# Altium schematic sheet Outputs.SchDoc: Controlled Outputs
size A4; DrawnBy: oaba200
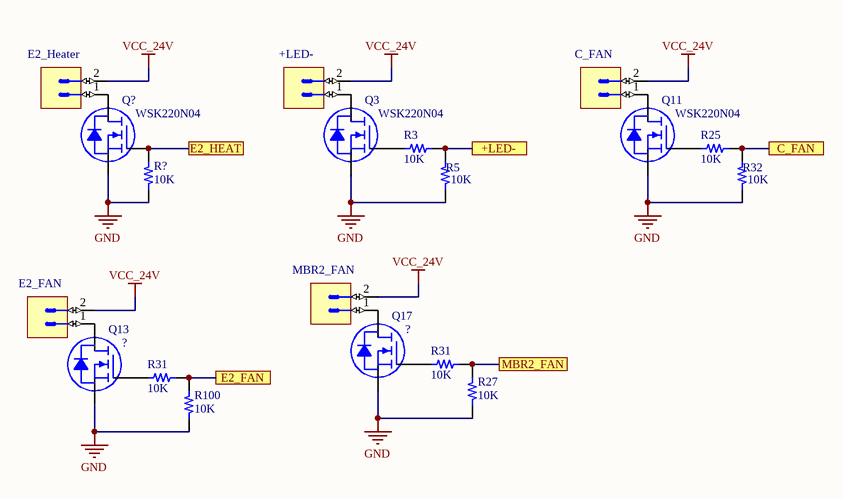
[diagram p0: Outputs.SchDoc]

## Parts
(Parts that share a designator on the sheet are numbered #1, #2 ... from top to bottom, then left to right.)
+LED-  (no value)
C_FAN  (no value)
E2_FAN  (no value)
E2_Heater  (no value)
MBR2_FAN  (no value)
Q3  WSK220N04  [TO263]
Q11  WSK220N04  [TO263]
Q13  ?  [TO263]
Q17  ?  [TO263]
Q?  WSK220N04  [TO263]
R3  10K  [RES 0805_2012]
R5  10K  [RES 0805_2012]
R25  10K  [RES 0805_2012]
R27  10K  [RES 0805_2012]
R31#1  10K  [RES 0805_2012]
R31#2  10K  [RES 0805_2012]
R32  10K  [RES 0805_2012]
R100  10K  [RES 0805_2012]
R?  10K  [RES 0805_2012]

## Ports
+LED-, C_FAN, E2_FAN, E2_HEAT, MBR2_FAN

## Nets
GND: Q3.2(S) Q11.2(S) Q13.2(S) Q17.2(S) Q?.2(S) R5.1 R27.1 R32.1 R100.1 R?.1
VCC_24V: +LED-.2 C_FAN.2 E2_FAN.2 E2_Heater.2 MBR2_FAN.2
+LED-: R3.2 R5.2 ; port +LED-
C_FAN: R25.2 R32.2 ; port C_FAN
E2_FAN: R31#2.2 R100.2 ; port E2_FAN
E2_HEAT: Q?.1(G) R?.2 ; port E2_HEAT
MBR2_FAN: R27.2 R31#1.2 ; port MBR2_FAN
Net+LED-_1: +LED-.1 Q3.3(D)
NetC_FAN_1: C_FAN.1 Q11.3(D)
NetE2_FAN_1: E2_FAN.1 Q13.3(D)
NetE2_Heater_1: E2_Heater.1 Q?.3(D)
NetMBR2_FAN_1: MBR2_FAN.1 Q17.3(D)
NetQ3_1: Q3.1(G) R3.1
NetQ11_1: Q11.1(G) R25.1
NetQ13_1: Q13.1(G) R31#2.1
NetQ17_1: Q17.1(G) R31#1.1

## Library data of the parts
+LED- C_FAN E2_FAN E2_Heater MBR2_FAN = Connector 2 Male
Q3 Q11 Q13 Q17 Q? = WSK220N04: N-Ch MOSFET / 40V  220A
R3 R5 R25 R27 R31#1 R31#2 R32 R100 R? = Resistor: SMT Resistor; VALUE: 10K
  R5 R27 R32 R100: Parameter 1: *